# EAGLE design 702_breakout_3pin (EAGLE 7.4.0)
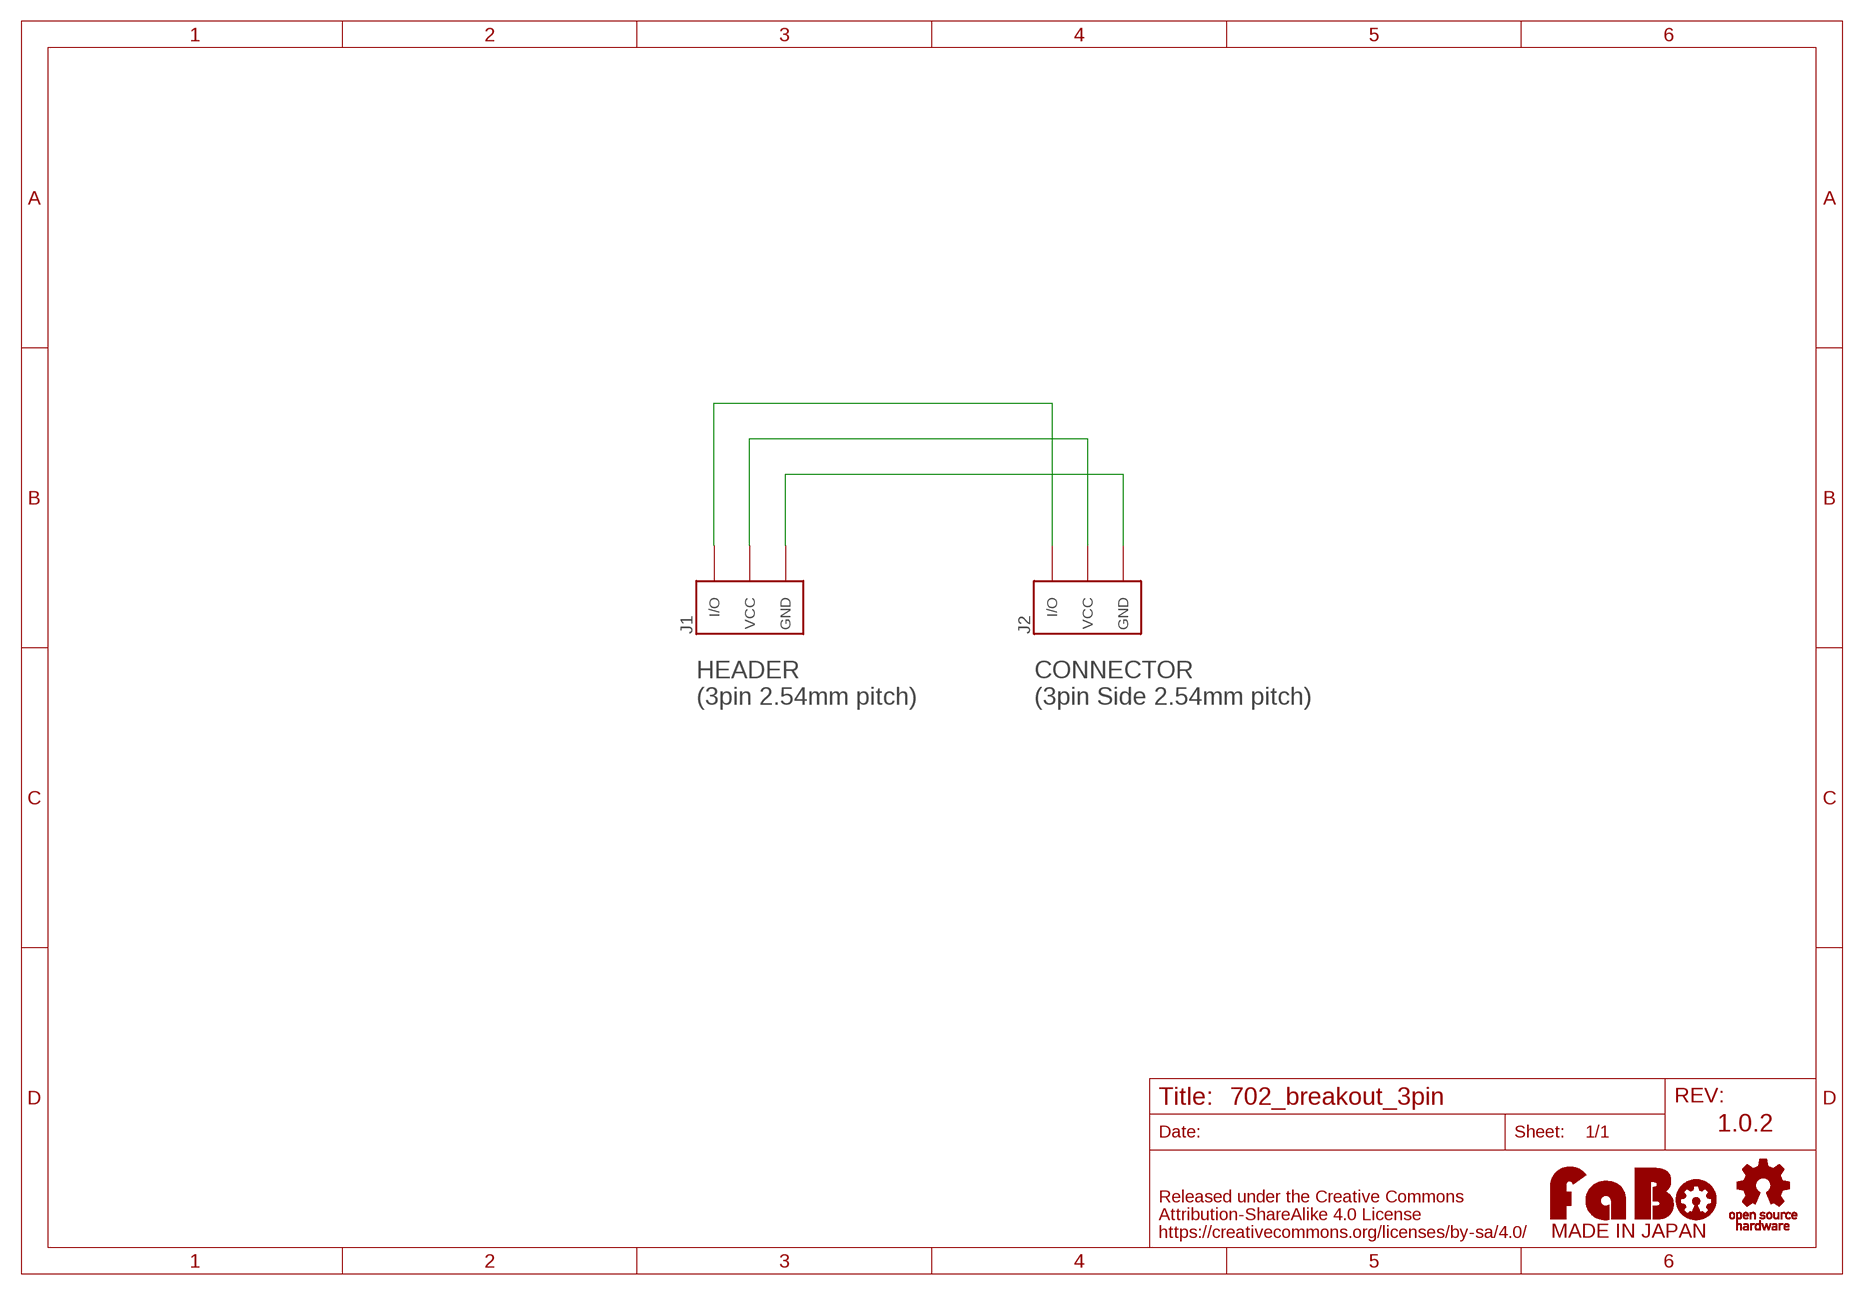
[diagram p0: schematic, sheet 1]

## Parts
J1  FABO_BRICK_3PIN-BREAKOUT  [FABO_BRICK_3PIN_BREAKOUT]
J2  FABO_BRICK_3PIN-CONNECTOR  [FABO_BRICK_3PIN_CONNECTOR]
U$2  LOGO_FABO-M_BOTTOM  [LOGO_FABO_MS_BOTTOM]
U$3  LOGO_OSHW-S_BOTTOM  [LOGO_OSHW_S_BOTTOM]

## Nets
GND: J1.GND J2.GND
IO: J1.I/O J2.IN/OUT(I/O)
VCC: J1.VCC J2.VCC

## Notes on the sheet
- HEADER
  (3pin 2.54mm pitch)
- CONNECTOR
  (3pin Side 2.54mm pitch)
- 1.0.2

## Library data of the parts
J1 J2 = FaBo-Template:FABO_BRICK_3PIN: FaBo Brick 3pin
U$2 = FaBo-etc:LOGO_FABO
U$3 = FaBo-etc:LOGO_OSHW

## Board
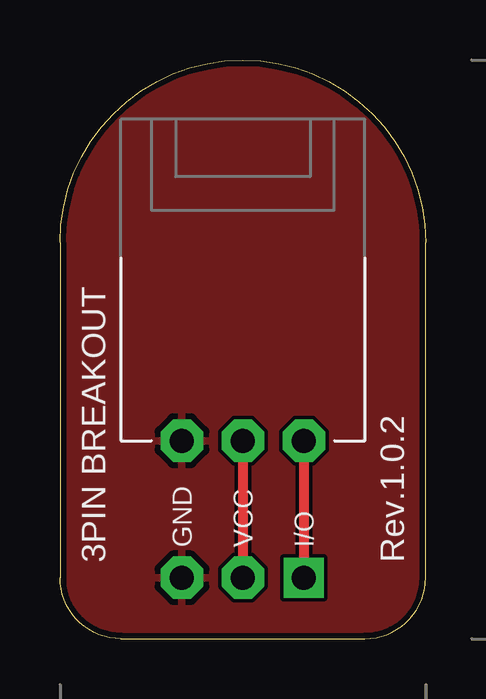
[diagram p1: board, top side]
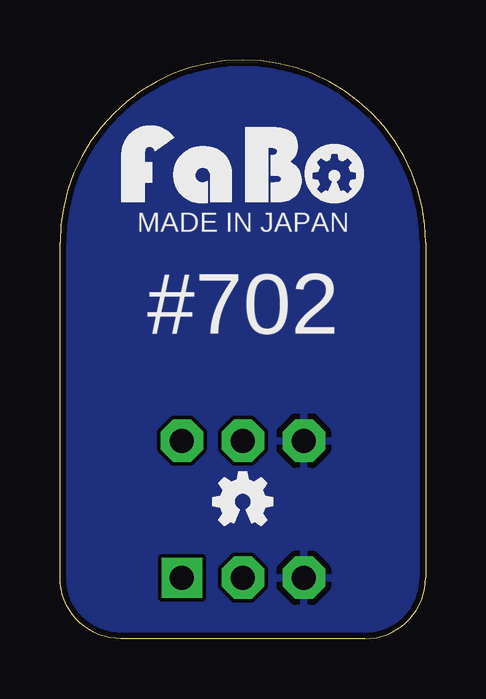
[diagram p2: board, bottom side, seen from below]

Size 15.24 x 24.13 mm. Coordinates in mm from the lower left corner, seen from the top.
Copper layers (1*16): Top 0.035mm / dielectric 1.5mm / Bottom 0.035mm
Design rules "Elecrow_2-layer_eagle_rule": minimum track width 6mil, minimum drill 12mil, track to track 6mil, track to pad 6mil, pad to pad 6mil, via to via 6mil, smd to smd 0mil, copper to edge 10mil, drill to drill 10mil, minimum pad ring 10mil, minimum via ring 6mil, stop-mask expansion 2mil, vias tented up to drill 100mil, thermal gap 10mil

### Footprints (pad centres in the part's own frame; a part is rotated, then mirrored left to right if it is on the bottom)
FABO_BRICK_3PIN_BREAKOUT = drill 1 pad 1.778 octagon: GND -2.54,-10.16; VCC 0,-10.16 | drill 1 pad 1.676 square: I/O 2.54,-10.16
FABO_BRICK_3PIN_CONNECTOR = drill 1 pad 1.778 octagon: GND -2.54,0; IN/OUT 2.54,0; VCC 0,0

### Placement (x,y rotation side)
J1  7.62,12.7 0 top
J2  7.62,8.26 0 top
U$2  7.62,17.78 0 top
U$3  7.62,5.71 0 top

### Tracks (layer width: path | path; a pad name or v marks a point on that pad's centre or on a via)
GND
  pour Bottom: -1.27,-1.27 16.51,-1.27 16.51,25.4 -1.27,25.4
  pour Top: -1.27,-1.27 16.51,-1.27 16.51,25.4 -1.27,25.4
IO
  Top 0.406: J2.IN/OUT J1.I/O
VCC
  Top 0.406: J2.VCC J1.VCC

### Text on the board
tPlace: 3PIN BREAKOUT | Rev.1.0.2
bPlace: MADE IN JAPAN | #702